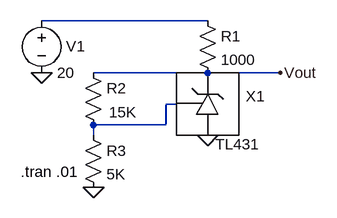
[diagram p0: schematic TL431_test.asc]
TL431_test.asc, the LTspice schematic file:
Version 4
SHEET 1 880 680
WIRE 240 80 -16 80
WIRE 240 160 64 160
WIRE 352 160 240 160
WIRE 192 208 176 208
WIRE 176 240 176 208
WIRE 176 240 64 240
WIRE 64 256 64 240
FLAG 240 256 0
FLAG -16 160 0
FLAG 64 336 0
FLAG 352 160 Vout
SYMBOL TL431 240 208 R0
WINDOW 0 59 -12 Left 0
SYMATTR InstName X1
SYMBOL res 224 64 R0
SYMATTR InstName R1
SYMATTR Value 1000
SYMBOL res 48 144 R0
WINDOW 3 40 77 Left 0
SYMATTR InstName R2
SYMATTR Value 15K
SYMBOL res 48 240 R0
SYMATTR InstName R3
SYMATTR Value 5K
SYMBOL voltage -16 64 R0
WINDOW 0 38 55 Left 0
WINDOW 123 0 0 Left 0
WINDOW 39 0 0 Left 0
SYMATTR InstName V1
SYMATTR Value 20
TEXT -48 312 Left 0 !.tran .01

The netlist it stands for:
* TL431_test.asc
XX1 Vout 0 N002 TL431  ; pins CATHODE ANODE REF
R1 N001 Vout 1000
R2 Vout N002 15K
R3 N002 0 5K
V1 N001 0 20
.tran .01
.lib TL431.sub
.backanno
.end